# EasyEDA Pro project STM32电赛单片机开发板.eprj, board PCB1
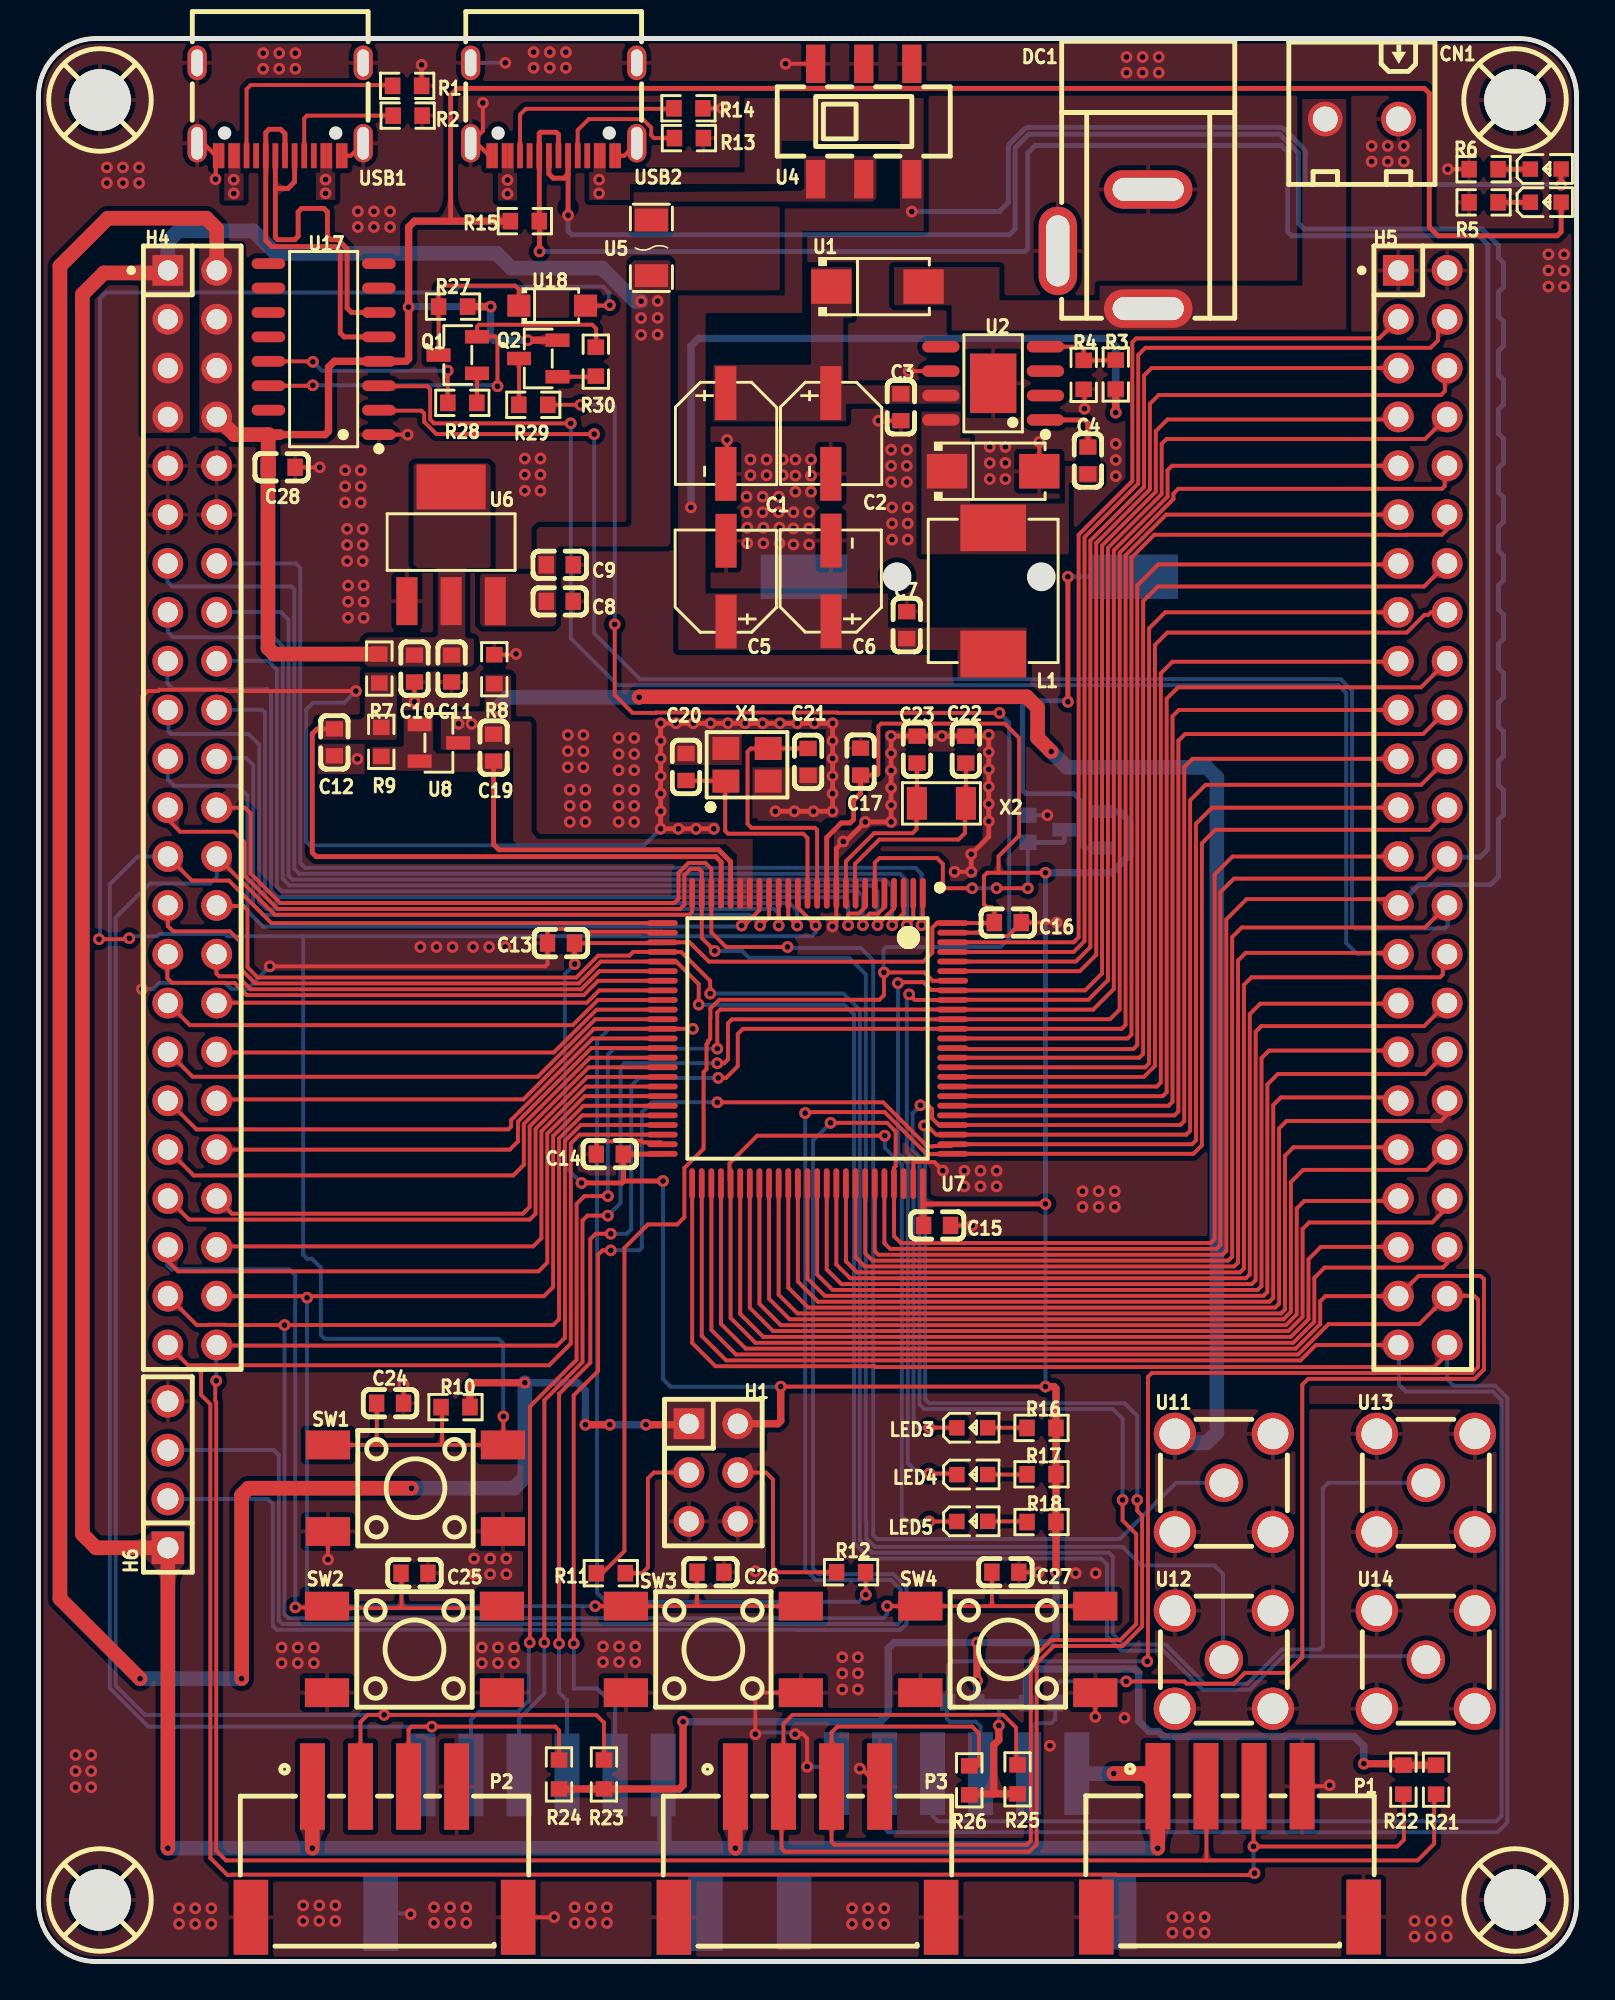
[diagram p3: board, top side]
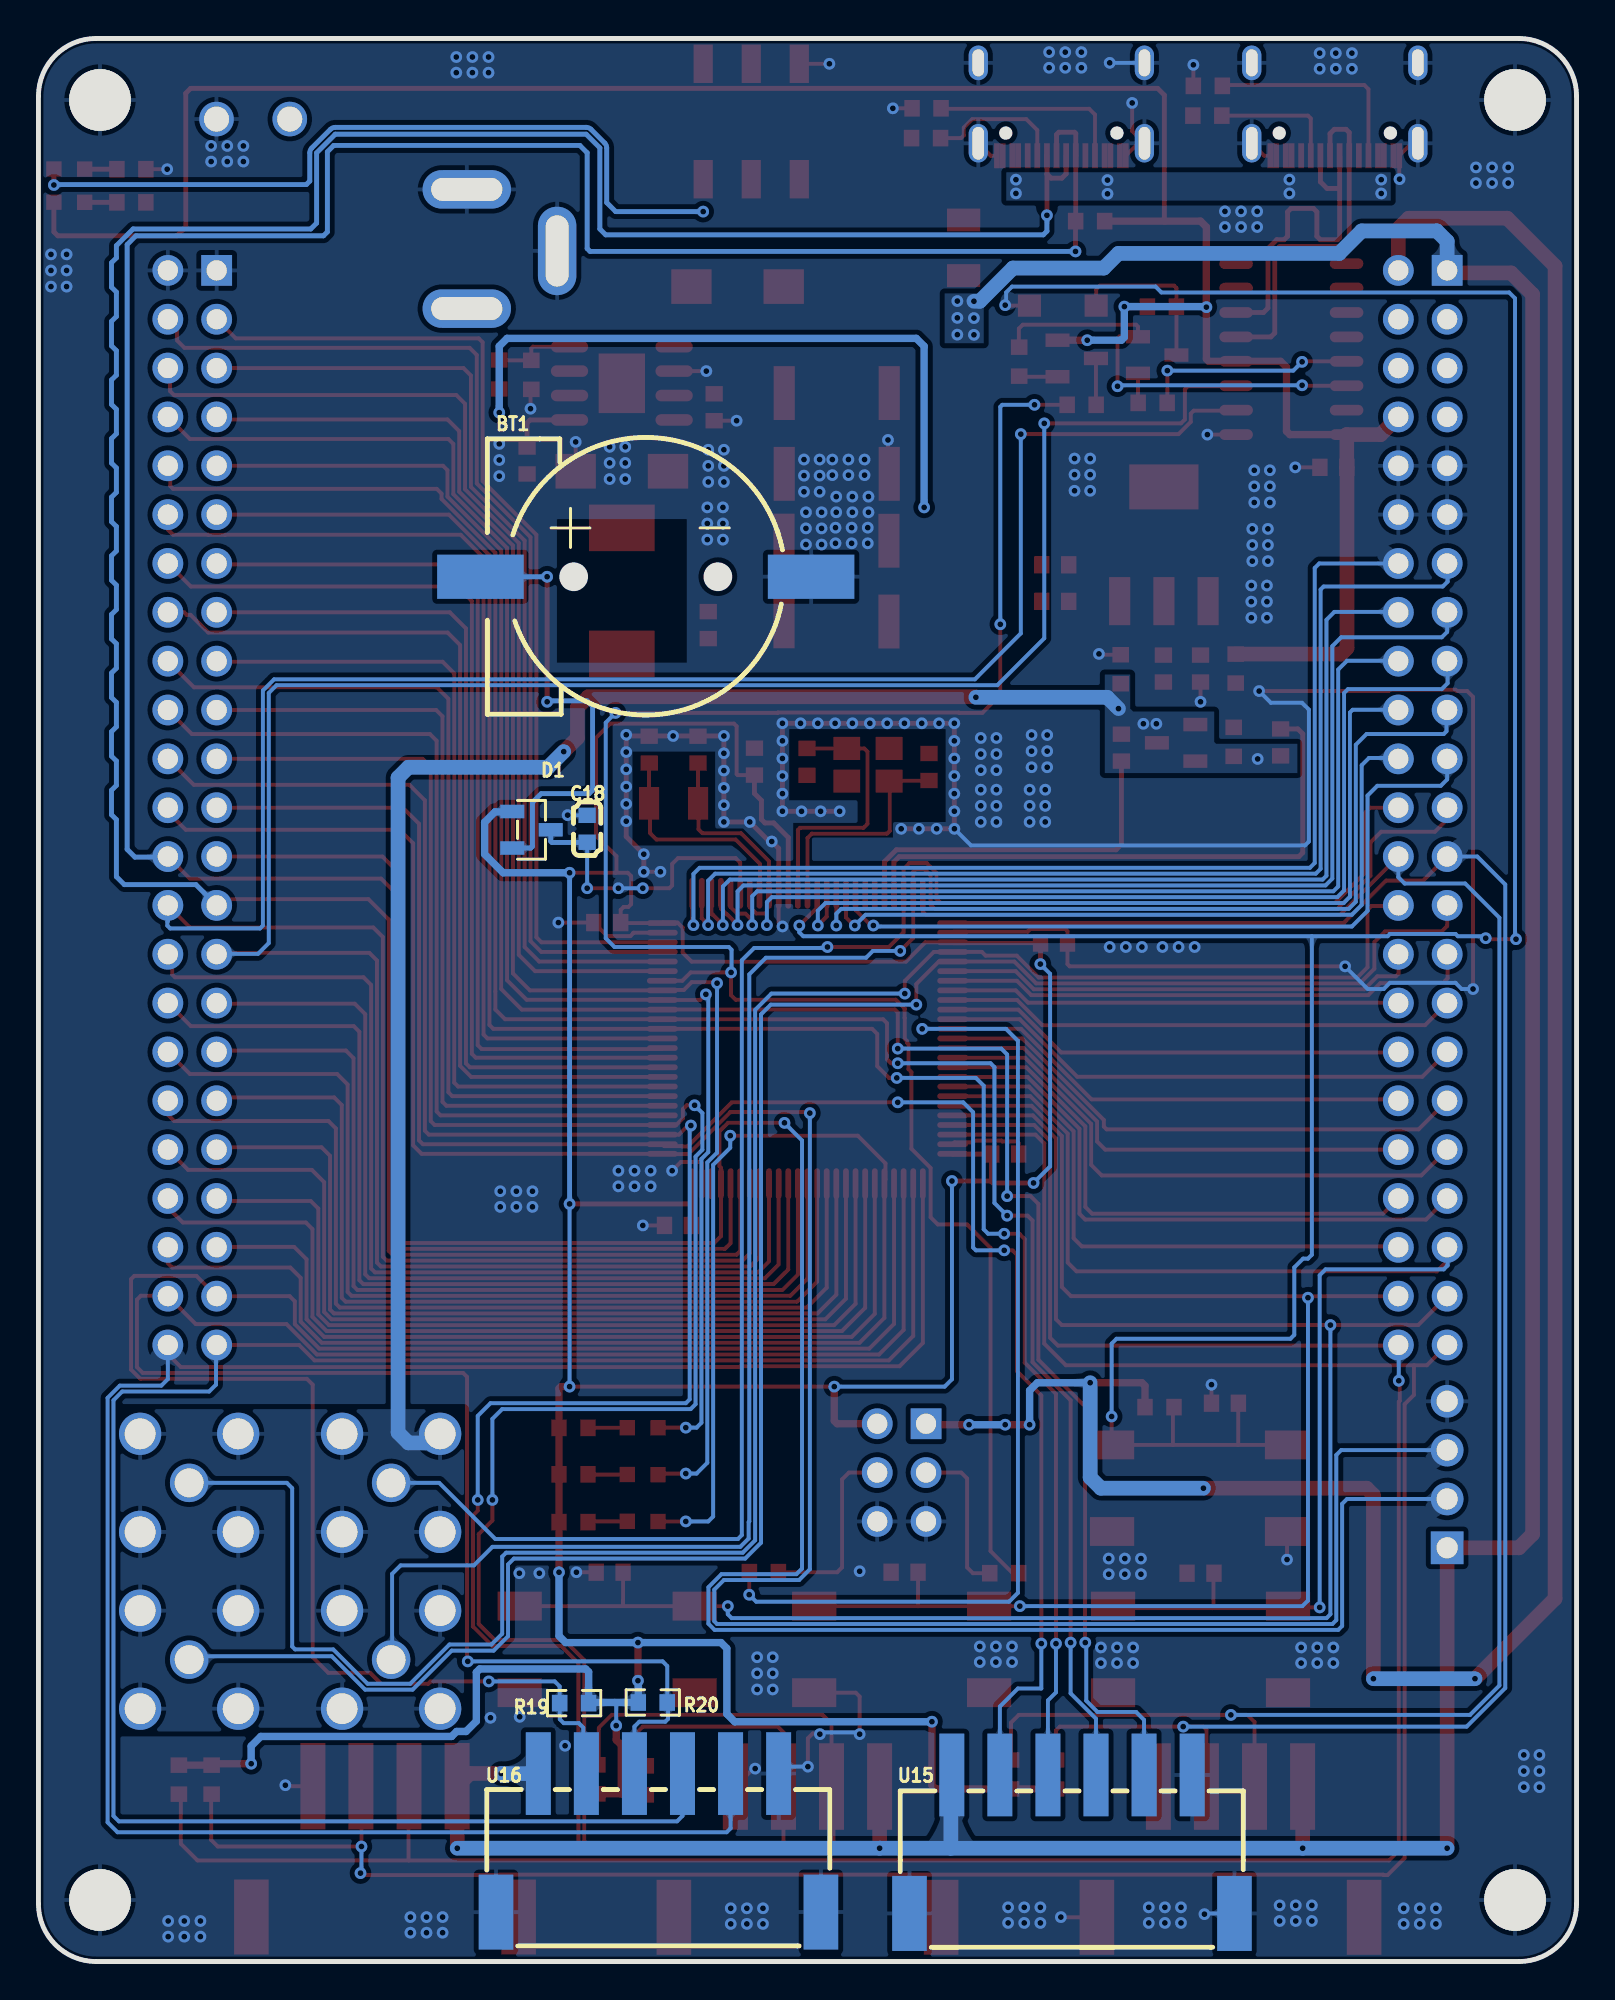
[diagram p4: board, bottom side, seen from below]

Outline 80 x 100 mm; copper layers: Top Layer, Bottom Layer. Coordinates in mm from the lower left corner of the outline.
Outline path: 0,97 0,3 arc(0.88,0.88) 3,0 77,0 arc(79.12,0.88) 80,3 80,97 arc(79.12,99.12) 77,100 3,100 arc(0.88,99.12) 0,97
Stack: Top Layer 0.035mm / Dielectric1 1.51mm FR4 er 4.5 / Bottom Layer 0.035mm

## Design rules (mm)
net PA12: DP2
net PA11: DP2
net DP: DP1
net DN: DP1
template: 自定义配置
spacing copperThickness1oz (default): track to track 0.102, other pairs 0.152 to 0.3
spacing copperThickness2oz: track to track 0.203, other pairs 0.152 to 0.3
track width copperThickness1oz (default): min 0.127, default 0.203, max 2.54
track width copperThickness2oz: min 0.203, default 0.254, max 2.54
differential pair differentialPair (default): width min 0.127, default 0.254, max 2.54; gap min 0.102, default 0.102
via viaSize (default): diameter min 0.5, default 0.61, max 10; hole min 0.3, default 0.305, max 6.3

## Placement (name value [footprint] x y rotation side)
BT1  CR1220-2ZX  [BAT-SMD_CR1220-2ZX]  48.41 72.01 180 bottom
C1  4.7uF  [CAP-SMD_BD5.0-L5.3-W5.3-FD]  35.75 79.46 270 top
C2  4.7uF  [CAP-SMD_BD5.0-L5.3-W5.3-FD]  41.21 79.46 270 top
C3  100nF  [C0603]  44.86 80.82 90 top
C4  10nF  [C0603]  54.58 78.05 270 top
C5  47uF  [CAP-SMD_BD5.0-L5.3-W5.3-FD]  35.76 71.78 90 top
C6  47uF  [CAP-SMD_BD5.0-L5.3-W5.3-FD]  41.22 71.79 90 top
C7  100nF  [C0603]  45.16 69.49 270 top
C8  10uF  [C0603]  27.11 70.73 180 top
C9  100nF  [C0603]  27.11 72.63 180 top
C10  100nF  [C0603]  19.56 67.23 90 top
C11  10uF  [C0603]  21.49 67.23 90 top
C12  10nF  [C0603]  15.39 63.4 90 top
C13  100nF  [C0603]  27.18 52.96 0 top
C14  100nF  [C0603]  29.72 41.99 0 top
C15  100nF  [C0603]  46.74 38.28 180 top
C16  100nF  [C0603]  50.42 54.03 180 top
C17  100nF  [C0603]  42.76 62.39 270 top
C18  100nF  [C0603]  51.46 58.9 90 bottom
C19  10uF  [C0603]  23.67 63.12 270 top
C20  20pF  [C0603]  33.68 62.12 90 top
C21  20pF  [C0603]  40.03 62.38 90 top
C22  10pF  [C0603]  48.23 63.02 270 top
C23  10pF  [C0603]  45.69 63.02 90 top
C24  100nF  [C0603]  18.29 29.03 0 top
C25  100nF  [C0603]  19.56 20.19 0 top
C26  100nF  [C0603]  34.95 20.24 0 top
C27  100nF  [C0603]  50.29 20.24 0 top
C28  100nF  [C0603]  12.65 77.7 0 top
CN1  MX128L-3.81-02P-GN01-Cu-Y-A  [CONN-TH_2P-P3.81_MX128L-3.81-GN01-02P-CU-Y-A]  68.83 95.81 180 top
D1  BAT54C  [SOT-23-3_L2.9-W1.3-P1.90-LS2.4-BR]  54.36 58.85 0 bottom
DC1  -  [DC-005_2.5]  57.4 89.18 90 top
H1  -  [HDR-TH_6P-P2.54-V-R2-C3-S2.54_A2541WV-2X3P]  35.1 25.43 270 top
H4  X6521WV-2x23H-C60D30  [HDR-TH_46P-2.54-V-M-R2-C23-S2.54]  8 60 270 top
H5  X6521WV-2x23H-C60D30  [HDR-TH_46P-2.54-V-M-R2-C23-S2.54]  72 60 270 top
H6  -  [HDR-TH_4P-P2.54-V-M]  6.73 25.32 90 top
L1  15uH  [IND-SMD_L7.3-W6.6]  49.66 71.27 90 top
LED1  -  [LED_0603]  78.45 91.49 0 top
LED2  -  [LED_0603]  78.45 93.22 0 top
LED3  -  [LED_0603]  48.62 27.76 0 top
LED4  -  [LED_0603]  48.62 25.33 0 top
LED5  -  [LED_0603]  48.62 22.89 0 top
P1  -  [CONN-SMD_XH2.54-4PSMD]  61.98 5.72 0 top
P2  -  [CONN-SMD_XH2.54-4PSMD]  18 5.7 0 top
P3  -  [CONN-SMD_XH2.54-4PSMD]  40 5.7 0 top
Q1  S8050  [SOT-23-3_L2.9-W1.3-P1.90-LS2.4-BR]  21.81 83.54 0 top
Q2  S8550  [SOT-23-3_L2.9-W1.3-P1.90-LS2.4-BR]  26 83.36 0 top
R1  5.1K  [R0603]  19.18 97.54 0 top
R2  5.1K  [R0603]  19.2 95.99 0 top
R3  10K  [R0603]  56.03 82.53 90 top
R4  3.16K  [R0603]  54.36 82.51 270 top
R5  2K  [R0603]  75.17 91.48 180 top
R6  5K  [R0603]  75.17 93.2 180 top
R7  0  [R0603]  17.73 67.23 270 top
R8  0  [R0603]  23.71 67.2 270 top
R9  1K  [R0603]  17.83 63.42 270 top
R10  10K  [R0603]  21.69 28.83 0 top
R11  10K  [R0603]  29.77 20.19 0 top
R12  10K  [R0603]  42.27 20.24 0 top
R13  5.1K  [R0603]  33.83 94.82 0 top
R14  5.1K  [R0603]  33.81 96.37 0 top
R15  10K  [R0603]  25.3 90.5 0 top
R16  2K  [R0603]  52.17 27.75 180 top
R17  2K  [R0603]  52.17 25.34 180 top
R18  2K  [R0603]  52.17 22.85 180 top
R19  4.7K  [R0603]  52.14 13.44 180 bottom
R20  4.7K  [R0603]  48.05 13.47 0 bottom
R21  4.7K  [R0603]  72.69 9.46 90 top
R22  4.7K  [R0603]  70.99 9.46 90 top
R23  4.7K  [R0603]  29.41 9.73 270 top
R24  4.7K  [R0603]  27.08 9.73 270 top
R25  4.7K  [R0603]  50.93 9.47 270 top
R26  4.7K  [R0603]  48.41 9.42 270 top
R27  10K  [R0603]  21.56 86.06 180 top
R28  1K  [R0603]  22.05 81.05 0 top
R29  1K  [R0603]  25.74 80.95 180 top
R30  1K  [R0603]  28.99 83.19 270 top
SCREW1  -  [M3螺丝]  3.2 96.8 0 top
SCREW2  -  [M3螺丝]  76.8 96.8 0 top
SCREW3  -  [M3螺丝]  3.2 3.2 0 top
SCREW4  -  [M3螺丝]  76.8 3.2 0 top
SW1  -  [SW-SMD_4P-L6.0-W6.0-P4.50-LS9.0-2]  19.61 24.61 0 top
SW2  -  [SW-SMD_4P-L6.0-W6.0-P4.50-LS9.0-2]  19.56 16.23 0 top
SW3  -  [SW-SMD_4P-L6.0-W6.0-P4.50-LS9.0-2]  35.1 16.23 0 top
SW4  -  [SW-SMD_4P-L6.0-W6.0-P4.50-LS9.0-2]  50.42 16.23 0 top
U1  SS54  [SMA_L4.2-W2.6-LS5.1-RD]  43.64 87.1 0 top
U2  TPS5450QDDARQ1  [SOIC-8_L4.9-W3.9-P1.27-LS6.0-BL-EP]  49.66 82.07 90 top
U3  SS54  [SMA_L4.2-W2.6-LS5.1-RD]  49.66 77.5 0 top
U4  YSSP2AG00  [SW-SMD_YSSP2AG00]  42.93 95.68 0 top
U5  JK-nSMD005/60V  [F1206]  31.88 89.11 270 top
U6  AMS1117-3.3  [SOT-223-3_L6.5-W3.4-P2.30-LS7.0-BR]  21.46 73.71 270 top
U7  STM32F103VET6  [LQFP-100_L14.0-W14.0-P0.50-LS16.0-BL]  40 48 180 top
U8  TL431  [SOT-23-3_L2.9-W1.3-P1.90-LS2.4-BR]  20.83 63.37 180 top
U11  6GHz  [SMA-TH_HL-SMA-KHD2]  61.66 24.89 0 top
U12  6GHz  [SMA-TH_HL-SMA-KHD2]  61.66 15.7 0 top
U13  6GHz  [SMA-TH_HL-SMA-KHD2]  72.16 24.89 0 top
U14  6GHz  [SMA-TH_HL-SMA-KHD2]  72.16 15.7 0 top
U15  XH2.54mm-LI-6P  [CONN-SMD_6P-P2.50-H]  26.24 6.1 180 bottom
U16  XH2.54mm-LI-6P  [CONN-SMD_6P-P2.50-H]  47.75 6.17 180 bottom
U17  CH340C  [SOP-16_L10.0-W3.9-P1.27-LS6.0-BL]  14.83 83.85 90 top
U18  1N4007W  [SOD-123FL_L2.7-W1.8-LS3.7-RD]  26.72 86.11 0 top
USB1  HC-TYPE-C-16P-01B  [USB-C-SMD_KH-TYPE-C-16P]  12.57 96.32 180 top
USB2  HC-TYPE-C-16P-01B  [USB-C-SMD_KH-TYPE-C-16P]  26.8 96.32 180 top
X1  8MHz  [CRYSTAL-SMD_4P-L3.2-W2.5-BL_SIT8008BI]  36.86 62.23 0 top
X2  SF32WK32768D61T002  [CRYSTAL-SMD_L3.2-W1.5-1]  46.96 60.22 0 top

## Footprints (pads in the part's own frame, mm; a bottom-side part is the same pattern mirrored in y, then rotated)
BAT-SMD_CR1220-2ZX
  rect 4.5x2.3 smd: 1(-8.6,0) 2(8.6,0)
C0603
  rect 0.8x0.9 smd: 1(-0.7,0) 2(0.7,0)
CAP-SMD_BD5.0-L5.3-W5.3-FD
  rect 2.8x1.1 smd: 1(-2.1,0) 2(2.1,0)
CONN-SMD_6P-P2.50-H
  rect 1.3x4.3 smd: 1(-6.25,3.6) 2(-3.751,3.6) 3(-1.25,3.6) 4(1.25,3.6) 5(3.75,3.6) 6(6.25,3.6)
  rect 1.8x3.9 smd: 7(-8.45,-3.6) 8(8.45,-3.6)
CONN-SMD_XH2.54-4PSMD
  rect 1.3x4.5 smd: 1(-3.75,3.4) 2(-1.25,3.4) 3(1.25,3.4) 4(3.75,3.4)
  rect 1.8x3.9 smd: 5(-6.95,-3.4) 6(6.95,-3.4)
CONN-TH_2P-P3.81_MX128L-3.81-GN01-02P-CU-Y-A
  round 1.8 hole 1.3: 1(-1.905,0) 2(1.905,0)
CRYSTAL-SMD_4P-L3.2-W2.5-BL_SIT8008BI
  rect 1.4x1.2 smd: 1(-1.1,-0.85) 2(1.1,-0.85) 3(1.1,0.85) 4(-1.1,0.85)
CRYSTAL-SMD_L3.2-W1.5-1
  rect 1.05x1.7 smd: 1(-1.275,0) 2(1.275,0)
DC-005_2.5
  oval 2x4.6 hole 1.2x3.7: 1(-3.227,-0.318) 2(2.973,-0.318)
  oval 4.6x2 hole 3.7x1.2: 3(-0.227,4.382)
F1206
  rect 1.19x1.728 smd: 1(-1.445,0) 2(1.445,0)
HDR-TH_4P-P2.54-V-M
  rect 1.7x1.7 hole 1.1: 1(-3.81,0)
  round 1.7 hole 1.1: 2(-1.27,0) 3(1.27,0) 4(3.81,0)
HDR-TH_6P-P2.54-V-R2-C3-S2.54_A2541WV-2X3P
  rect 1.6x1.6 hole 1.05: 1(-2.54,-1.27)
  round 1.6 hole 1.05: 2(-2.54,1.27) 3(0,-1.27) 4(0,1.27) 5(2.54,-1.27) 6(2.54,1.27)
HDR-TH_46P-2.54-V-M-R2-C23-S2.54
  rect 1.6x1.6 hole 1.05: 1(-27.94,-1.27)
  round 1.6 hole 1.05: 2(-27.94,1.27) 3(-25.4,-1.27) 4(-25.4,1.27) 5(-22.86,-1.27) 6(-22.86,1.27) 7(-20.32,-1.27) 8(-20.32,1.27) 9(-17.78,-1.27) 10(-17.78,1.27) 11(-15.24,-1.27) 12(-15.24,1.27) 13(-12.7,-1.27) 14(-12.7,1.27) 15(-10.16,-1.27) 16(-10.16,1.27) 17(-7.62,-1.27) 18(-7.62,1.27) 19(-5.08,-1.27) 20(-5.08,1.27) 21(-2.54,-1.27) 22(-2.54,1.27) 23(0,-1.27) 24(0,1.27) 25(2.54,-1.27) 26(2.54,1.27) 27(5.08,-1.27) 28(5.08,1.27) 29(7.62,-1.27) 30(7.62,1.27) 31(10.16,-1.27) 32(10.16,1.27) 33(12.7,-1.27) 34(12.7,1.27) 35(15.24,-1.27) 36(15.24,1.27) 37(17.78,-1.27) 38(17.78,1.27) 39(20.32,-1.27) 40(20.32,1.27) 41(22.86,-1.27) 42(22.86,1.27) 43(25.4,-1.27) 44(25.4,1.27) 45(27.94,-1.27) 46(27.94,1.27)
IND-SMD_L7.3-W6.6
  rect 2.424x3.42 smd: 1(3.278,0) 2(-3.278,0)
LED_0603
  rect 0.8x0.8 smd: 1(-0.851,-0.01) 2(0.75,-0.005)
LQFP-100_L14.0-W14.0-P0.50-LS16.0-BL
  oval 0.3x1.6 smd: 1(-6,-7.55) 2(-5.5,-7.55) 3(-5,-7.55) 4(-4.5,-7.55) 5(-4,-7.55) 6(-3.5,-7.55) 7(-3,-7.55) 8(-2.5,-7.55) 9(-2,-7.55) 10(-1.5,-7.55) 11(-1,-7.55) 12(-0.5,-7.55) 13(0,-7.55) 14(0.5,-7.55) 15(1,-7.55) 16(1.5,-7.55) 17(2,-7.55) 18(2.5,-7.55) 19(3,-7.55) 20(3.5,-7.55) 21(4,-7.55) 22(4.5,-7.55) 23(5,-7.55) 24(5.5,-7.55) 25(6,-7.55) 51(6,7.55) 52(5.5,7.55) 53(5,7.55) 54(4.5,7.55) 55(4,7.55) 56(3.5,7.55) 57(3,7.55) 58(2.5,7.55) 59(2,7.55) 60(1.5,7.55) 61(1,7.55) 62(0.5,7.55) 63(0,7.55) 64(-0.5,7.55) 65(-1,7.55) 66(-1.5,7.55) 67(-2,7.55) 68(-2.5,7.55) 69(-3,7.55) 70(-3.5,7.55) 71(-4,7.55) 72(-4.5,7.55) 73(-5,7.55) 74(-5.5,7.55) 75(-6,7.55)
  oval 1.6x0.3 smd: 26(7.55,-6) 27(7.55,-5.5) 28(7.55,-5) 29(7.55,-4.5) 30(7.55,-4) 31(7.55,-3.5) 32(7.55,-3) 33(7.55,-2.5) 34(7.55,-2) 35(7.55,-1.5) 36(7.55,-1) 37(7.55,-0.5) 38(7.55,0) 39(7.55,0.5) 40(7.55,1) 41(7.55,1.5) 42(7.55,2) 43(7.55,2.5) 44(7.55,3) 45(7.55,3.5) 46(7.55,4) 47(7.55,4.5) 48(7.55,5) 49(7.55,5.5) 50(7.55,6) 76(-7.55,6) 77(-7.55,5.5) 78(-7.55,5) 79(-7.55,4.5) 80(-7.55,4) 81(-7.55,3.5) 82(-7.55,3) 83(-7.55,2.5) 84(-7.55,2) 85(-7.55,1.5) 86(-7.55,1) 87(-7.55,0.5) 88(-7.55,0) 89(-7.55,-0.5) 90(-7.55,-1) 91(-7.55,-1.5) 92(-7.55,-2) 93(-7.55,-2.5) 94(-7.55,-3) 95(-7.55,-3.5) 96(-7.55,-4) 97(-7.55,-4.5) 98(-7.55,-5) 99(-7.55,-5.5) 100(-7.55,-6)
M3螺丝
  round 3.2 hole 3.2: 1(0,0)
R0603
  rect 0.806x0.864 smd: 1(-0.753,0) 2(0.753,0)
SMA-TH_HL-SMA-KHD2
  round 2.2 hole 1.6: 1(-2.55,2.55) 2(2.55,2.55) 3(2.55,-2.55) 4(-2.55,-2.55)
  round 2 hole 1.5: 5(0,0)
SMA_L4.2-W2.6-LS5.1-RD
  rect 2.1x1.8 smd: 1(-2.4,0) 2(2.4,0)
SOD-123FL_L2.7-W1.8-LS3.7-RD
  rect 1.2x1.15 smd: 1(-1.735,0) 2(1.735,0)
SOIC-8_L4.9-W3.9-P1.27-LS6.0-BL-EP
  oval 0.602x1.941 smd: 1(-1.905,-2.72) 2(-0.635,-2.72) 3(0.635,-2.72) 4(1.905,-2.72) 5(1.905,2.72) 6(0.635,2.72) 7(-0.635,2.72) 8(-1.905,2.72)
  rect 3.098x2.41 smd: 9(0,0)
SOP-16_L10.0-W3.9-P1.27-LS6.0-BL
  oval 0.56x1.745 smd: 1(-4.445,-2.873) 2(-3.175,-2.873) 3(-1.905,-2.873) 4(-0.635,-2.873) 5(0.635,-2.873) 6(1.905,-2.873) 7(3.175,-2.873) 8(4.445,-2.873) 9(4.445,2.873) 10(3.175,2.873) 11(1.905,2.873) 12(0.635,2.873) 13(-0.635,2.873) 14(-1.905,2.873) 15(-3.175,2.873) 16(-4.445,2.873)
SOT-23-3_L2.9-W1.3-P1.90-LS2.4-BR
  rect 1.25x0.7 smd: 1(1,-0.95) 2(1,0.95) 3(-1,0)
SOT-223-3_L6.5-W3.4-P2.30-LS7.0-BR
  rect 2.5x1.1 smd: 1(2.97,-2.3) 2(2.97,0) 3(2.97,2.3)
  rect 2.34x3.6 smd: 4(-2.97,0)
SW-SMD_4P-L6.0-W6.0-P4.50-LS9.0-2
  rect 2.3x1.5 smd: 1(-4.55,2.25) 2(4.55,2.25) 3(-4.55,-2.25) 4(4.55,-2.25)
SW-SMD_YSSP2AG00
  rect 1x2 smd: 1(-2.5,3) 2(0,3) 3(2.5,3) 4(-2.5,-3) 5(0,-3) 6(2.5,-3)
USB-C-SMD_KH-TYPE-C-16P
  oval 1x2 hole 0.6x1.7: 1(-4.32,1.765) 2(4.32,1.765)
  oval 1x1.8 hole 0.6x1.4: 3(-4.32,-2.415) 4(4.32,-2.415)
  rect 0.3x1.3 smd: A1(-3.35,2.415) A4(-2.55,2.415) A5(-1.25,2.415) A6(-0.25,2.415) A7(0.25,2.415) A8(1.25,2.415) A9(2.55,2.415) A12(3.35,2.415) B1(3.05,2.415) B4(2.25,2.415) B5(1.75,2.415) B6(0.75,2.415) B7(-0.75,2.415) B8(-1.75,2.415) B9(-2.25,2.415) B12(-3.05,2.415)

## Nets
As in the schematic.

Pads without a net: U2 2 3 5; U7 73; U17 7 8 9 10 11 12 15; USB1 A8 B8; USB2 A8 B8

## Via types
v1: diameter 0.61, hole 0.305, Top Layer to Bottom Layer, 449 vias

## Routing (per net, layer and track width the routed paths; a pad name or vN(x,y) marks a point on that pad's centre or on a via; arc(x,y) is an arc through that point)
AGND: length 77.1
  Top Layer w0.762: v1(52.68,62.92) 51.97,63.63 51.97,65.2 51.4,65.77 31.27,65.77 v1(31.24,65.74)
  Bottom Layer w0.762: v1(52.68,62.92) 53.49,62.1 60.76,62.1 61.3,61.56 61.3,27.51 60.76,26.97 59.58,26.97 U11.1 ; v1(31.24,65.74) 24.41,65.74 v1(23.82,65.15)
  vias: v1(16.59,62.53) v1(21.85,64.36) v1(22.53,64.36)
GND: length 198.7
  Top Layer w0.203: v1(24.84,68) 24.8,67.95 R8.1 ; C10.1 v1(19.56,65.51) ; R4.2 54.41,81.71 v1(54.41,80.75) ; v1(26.82,2.31) 26.81,2.3 P2.6 ; v1(12.04,51.75) 26.37,51.75 26.48,51.86 C13.1 26.48,53.58 26.59,53.69 28.4,53.69 28.55,53.55 32.4,53.55 U7.27 ; USB2.1 30.47,93.9 USB2.A1 ; v1(16.51,66.07) 9.77,66.07 9.71,66.13 6.29,66.13 6.23,66.07 5.69,66.07 5.39,65.76 v1(5.39,50.57) ; v1(67.16,9.17) 67.1,9.12 P1.4 ; v1(48.51,56.67) v1(47.65,56.67) ; 39.32,11.86 39.73,11.86 39.98,11.61 v1(39.98,10.13) ; U2.6 v1(45.26,82.7) ; 52.06,77.5 v1(52.06,79.02) ; C14.1 29.02,42.56 29.11,42.65 29.87,42.65 29.91,42.69 31.34,42.69 31.44,42.6 32.35,42.6 U7.49 ; 39.65,13.98 37.49,13.98 37.29,13.78 v1(37.29,11.82) ; v1(35.81,79.12) 35.81,77.42 C1.2 ; C15.1 v1(48.56,38.28) ; R1.2 v1(19.93,98.63) ; U17.1 v1(19.2,79.4) ; C24.2 v1(18.99,30) ; 44.86,80.12 v1(43.69,80.12) ; U7.74 45.5,41.51 45.57,41.58 46.58,41.58 v1(47.04,41.12) ; C27.2 v1(52.02,20.24) ; v1(41.3,53.82) 41.5,54.02 U7.10 ; USB1.1 16.24,93.9 15.92,93.9 ; 54.97,13.98 v1(54.97,12.73) ; P3.4 42.82,10.03 v1(42.72,10.03) ; U7.99 49.05,53.5 49.06,53.49 49.06,53.47 49.21,53.32 50.41,53.32 C16.1 52.88,54.03 ; 15.06,22.36 v1(15.06,20.9) ; USB2.A12 22.8,94.55 USB2.2 23.11,95.19 v1(23.11,96.65) ; 9.22,92.69 USB1.A12 8.57,94.55 USB1.2 ; R14.2 v1(35.56,96.37) ; C28.2 v1(14.63,77.7) ; 74.41,93.2 v1(73.3,93.2) ; U4.1 v1(38.86,98.68)
  Top Layer w0.254: v1(38.33,59.81) v1(39.32,59.81) v1(40.31,59.81) 41.3,59.81 v1(41.3,59.82) v1(41.3,60.73) v1(41.3,61.65) v1(41.3,62.56) v1(41.3,63.47) v1(41.3,64.39) v1(40.36,64.39) v1(39.46,64.39) v1(38.56,64.39) v1(37.67,64.39) v1(36.76,64.39) v1(35.86,64.39) v1(34.96,64.39) v1(34.06,64.39) v1(33.16,64.39) v1(32.36,64.39) v1(32.36,63.47) v1(32.36,62.56) v1(32.36,61.65) v1(32.36,60.73) v1(32.36,59.82) 32.36,58.91 v1(32.36,58.9) v1(33.28,58.9) v1(34.21,58.9) v1(35.13,58.9) ; v1(48.51,56.67) v1(48.51,57.58) 49.43,58.5 v1(49.43,59.3) v1(49.43,60.2) v1(49.43,61.09) v1(49.43,61.99) v1(49.43,62.89) v1(49.43,63.79) 49.37,63.73 v1(46.99,63.73) v1(44.35,63.73) v1(44.35,62.83) v1(44.35,61.93) v1(44.35,61.03) v1(44.35,60.13) v1(44.35,59.26) v1(43,59.26) 41.99,58.24 v1(41.86,58.24) 41.5,57.88 U7.10
  Bottom Layer w0.203: v1(5.39,50.57) 5.97,50.57 6.29,50.89 9.71,50.89 10.03,50.57 10.86,50.57 v1(12.04,51.75) ; v1(16.51,66.07) 15.9,65.46 14.28,65.46 13.92,65.1 13.92,58.24 14.12,58.04 31.5,58.04 v1(32.36,58.9) ; C18.2 52.47,59.6 v1(52.48,59.61) ; USB2.4 v1(24.28,98.73) ; v1(39.36,11.82) 39.27,11.91 37.29,11.91 ; U16.6 41.14,10.13 v1(39.98,10.13) ; U15.8 19.32,2.5 v1(19.35,2.46)
  vias: v1(1.93,10.74) v1(1.93,9.91) v1(1.93,9.07) v1(2.74,10.74) v1(2.74,9.91) v1(2.74,9.07) v1(3.56,93.29) v1(3.56,92.48) v1(4.39,93.29) v1(4.39,92.48) v1(5.23,93.29) v1(5.23,92.48) v1(7.31,2.77) v1(7.31,1.96) v1(8.15,2.77) v1(8.15,1.96) v1(8.99,2.77) v1(8.99,1.96) v1(9.21,92.69) v1(11.68,99.24) v1(11.68,98.42) v1(12.52,99.24) v1(12.52,98.42) v1(12.65,16.33) v1(12.65,15.52) v1(13.36,99.24) v1(13.36,98.42) v1(13.49,16.33) v1(13.49,15.52) v1(13.77,2.92) v1(13.77,2.11) v1(14.33,16.33) v1(14.33,15.52) v1(14.61,2.92) v1(14.61,2.11) v1(15.44,2.92) v1(15.44,2.11) v1(15.95,77.55) v1(15.95,76.71) v1(15.95,75.87) v1(16.05,74.5) v1(16.05,73.66) v1(16.05,72.82) v1(16.1,71.55) v1(16.1,70.71) v1(16.1,69.88) v1(16.61,91.01) v1(16.61,90.2) v1(16.76,77.55) v1(16.76,76.71) v1(16.76,75.87) v1(16.87,74.5) v1(16.87,73.66) v1(16.87,72.82) v1(16.92,71.55) v1(16.92,70.71) v1(16.92,69.88) v1(17.45,91.01) v1(17.45,90.2) v1(18.29,91.01) v1(18.29,90.2) v1(19.86,52.76) v1(20.57,2.82) v1(20.57,2.01) v1(20.7,52.76) v1(21.41,2.82) v1(21.41,2.01) v1(21.54,52.76) v1(22.25,2.82) v1(22.25,2.01) v1(22.61,52.76) v1(22.66,20.96) v1(22.66,20.14) v1(23.06,16.33) v1(23.06,15.52) v1(23.44,52.76) v1(23.5,20.96) v1(23.5,20.14) v1(23.9,16.33) v1(23.9,15.52) v1(24.28,52.76) v1(24.33,20.96) v1(24.33,20.14) v1(24.74,16.33) v1(24.74,15.52) v1(25.3,78.16) v1(25.3,77.32) v1(25.3,76.48) v1(25.76,99.29) v1(25.76,98.48) v1(26.11,78.16) v1(26.11,77.32) v1(26.11,76.48) v1(26.59,99.29) v1(26.59,98.48) v1(27.43,99.29) v1(27.43,98.48) v1(27.53,63.78) v1(27.53,62.94) v1(27.53,62.1) v1(27.63,60.94) v1(27.63,60.1) v1(27.63,59.26) v1(27.89,2.82) v1(27.89,2.01) v1(28.35,63.78) v1(28.35,62.94) v1(28.35,62.1) v1(28.45,60.94) v1(28.45,60.1) v1(28.45,59.26) v1(28.73,2.82) v1(28.73,2.01) v1(29.36,16.38) v1(29.36,15.57) v1(29.57,2.82) v1(29.57,2.01) v1(30.18,63.63) v1(30.18,62.79) v1(30.18,61.95) v1(30.18,60.94) v1(30.18,60.1) v1(30.18,59.26) v1(30.2,16.38) v1(30.2,15.57) v1(30.99,63.63) v1(30.99,62.79) v1(30.99,61.95) v1(30.99,60.94) v1(30.99,60.1) v1(30.99,59.26) v1(31.04,16.38) v1(31.04,15.57) v1(36.83,76.17) v1(36.83,75.36) v1(36.87,74.56) v1(36.87,73.75) v1(37.03,78.11) v1(37.03,77.29) v1(37.29,20.29) v1(37.67,76.17) v1(37.67,75.36) v1(37.71,74.56) v1(37.71,73.75) v1(37.87,78.11) v1(37.87,77.29) v1(38.51,76.17) v1(38.51,75.36) v1(38.54,74.56) v1(38.54,73.75) v1(38.71,78.11) v1(38.71,77.29) v1(39.27,75.36) v1(39.27,74.52) v1(39.27,73.69) v1(39.37,78.11) v1(39.37,77.27) v1(39.37,76.43) v1(40.08,75.36) v1(40.08,74.52) v1(40.08,73.69) v1(40.18,78.11) v1(40.18,77.27) v1(40.18,76.43) v1(41.81,15.82) v1(41.81,14.99) v1(41.81,14.15) v1(42.32,2.77) v1(42.32,1.96) v1(42.62,15.82) v1(42.62,14.99) v1(42.62,14.15) v1(43.15,2.77) v1(43.15,1.96) v1(43.99,2.77) v1(43.99,1.96) v1(44.35,78.61) v1(44.35,77.78) v1(44.35,76.94) v1(44.4,75.62) v1(44.4,74.78) v1(44.4,73.94) v1(45.16,78.61) v1(45.16,77.78) v1(45.16,76.94) v1(45.21,75.62) v1(45.21,74.78) v1(45.21,73.94) v1(48.16,41.12) v1(48.16,40.31) v1(49,41.12) v1(49,40.31) v1(49.48,78.77) v1(49.48,77.93) v1(49.48,77.09) v1(49.84,41.12) v1(49.84,40.31) v1(50.29,78.77) v1(50.29,77.93) v1(50.29,77.09) v1(52.61,11.22) v1(52.96,54.03) v1(53.95,20.19) v1(54.31,40.06) v1(54.31,39.24) v1(54.99,20.19) v1(55.14,40.06) v1(55.14,39.24) v1(56.03,78.92) v1(56.03,78.08) v1(56.03,77.24) v1(55.98,40.06) v1(55.98,39.24) v1(56.49,12.68) v1(56.59,99.03) v1(56.59,98.22) v1(57.43,99.03) v1(57.43,98.22) v1(58.27,99.03) v1(58.27,98.22) v1(58.98,2.31) v1(58.98,1.5) v1(59.82,2.31) v1(59.82,1.5) v1(60.66,2.31) v1(60.66,1.5) v1(69.34,94.41) v1(69.34,93.6) v1(70.18,94.41) v1(70.18,93.6) v1(71.02,94.41) v1(71.02,93.6) v1(71.58,2.11) v1(71.58,1.3) v1(72.42,2.11) v1(72.42,1.3) v1(73.25,2.11) v1(73.25,1.3) v1(78.54,88.77) v1(78.54,87.94) v1(78.54,87.1) v1(79.35,88.77) v1(79.35,87.94) v1(79.35,87.1)
VCC+3.3V: length 504.5
  Top Layer w0.203: 49.96,56.65 49.94,56.67 49.94,57.48 51,58.55 51,63.63 50.26,64.37 43.82,64.37 43.69,64.23 43.69,61.75 43.63,61.69 C17.2 ; 49.96,56.65 49.96,56.62 49.35,56.62 49.17,56.44 49.17,54.98 49.32,54.84 49.56,54.84 49.72,54.69 C16.2 49.69,54 U7.100 47.52,54.03 46.76,54.03 46.49,53.76 46.49,52.46 46.02,51.99 34.88,51.99 33.87,53 U7.28 32.41,52.96 C13.2 ; 49.96,56.65 49.99,56.62 v1(52.38,56.62) ; v1(38.61,29.9) v1(52.38,29.9)
  Top Layer w0.254: 79.2,91.49 79.2,89.94 78.99,89.74 72.8,89.74 72.34,90.2 72.34,97.15 72.09,97.4 21.79,97.4 21.44,97.05 21.44,90.52 21.41,90.5 ; C13.2 27.88,51.88 v1(27.89,51.87) ; v1(52.38,39.4) 46.02,39.4 46,39.42 ; U7.75 46,39.42 ; 46,39.42 46,38.32 C15.2 ; 30.46,40.59 v1(32.49,40.59) ; 30.46,40.59 30.43,40.61 30.43,41.97 C14.2 32.44,41.99 U7.50 ; 30.46,40.59 30.35,40.49 v1(28.24,40.49) ; C17.2 42.76,60.74 42.39,60.38 42.39,59.39 42.22,59.21 41.76,59.21 41,58.45 U7.11
  Top Layer w0.381: U17.16 14.91,79.4 15.09,79.58 15.09,82.91 15.39,83.21 U17.4 19.13,83.21 19.25,83.34 v1(19.25,86.03) 19.25,90.2 19.56,90.5 R15.1 ; R27.1 v1(23.52,86.06) ; R24.2 R23.2 33.33,8.97 33.53,9.17 v1(33.53,12.47) ; Q2.2 v1(25.45,84.31) ; R26.2 48.46,8.72 49.69,8.72 ; H1.1 33.78,27.91 v1(31.6,27.91) ; v1(25.3,30.1) 22.61,30.1 22.44,29.94 R10.2 ; 72.69,10.21 R22.2 70.92,10.29 v1(68.94,10.29) ; v1(38.61,29.9) 38.61,28.12 38.46,27.97 36.37,27.97 ; v1(48.82,16.59) v1(48.82,14.6) ; v1(52.38,29.9) 52.82,29.9 52.93,29.79 R16.1 R17.1 R18.1 v1(52.93,20.24) ; R25.2 49.69,8.72 ; 49.69,8.72 49.69,11.26 49.95,11.52 v1(49.95,12.27) ; v1(28.45,27.91) v1(29.72,27.91)
  Top Layer w0.762: H4.8 10.19,79.4 U17.16 11.95,79.39 C28.1 11.94,77.69 11.94,68.3 12.25,67.99 R7.1 ; v1(10.57,14.71) 10.57,24.26 10.92,24.61 v1(19.41,24.61) ; H4.2 9.27,90.11 8.73,90.65 3.61,90.65 1.12,88.16 1.12,18.87 v1(5.28,14.71)
  Bottom Layer w0.203: v1(38.61,29.9) 32.87,29.9 32.49,30.28 v1(32.49,40.59) ; v1(49.95,12.27) 49.95,13.39 50.03,13.47 ; v1(28.24,40.49) 27.38,41.35 27.38,51.36 v1(27.89,51.87) ; v1(52.38,29.9) v1(52.38,39.4)
  Bottom Layer w0.254: v1(52.38,56.62) v1(52.38,39.4)
  Bottom Layer w0.381: v1(52.93,20.24) 52.93,16.93 52.58,16.59 v1(48.82,16.59) 44.5,16.59 44.2,16.28 44.2,12.88 43.79,12.47 v1(33.53,12.47) ; v1(19.25,86.03) 19.28,86.06 v1(23.52,86.06) 23.52,84.46 23.67,84.31 v1(25.45,84.31) ; v1(52.38,56.62) 55.83,56.62 56.79,57.58 56.79,59.24 56.26,59.78 55.38,59.78 D1.1 ; v1(68.94,10.29) 68.94,11.2 68.43,11.71 58.51,11.71 58.25,11.96 57.76,11.96 57.22,12.5 57.22,15.04 57.05,15.21 51.54,15.21 51.38,15.06 R19.2 51.35,13.47 R20.2 48.8,14.59 v1(48.82,14.6) ; v1(25.3,30.1) 28.04,30.1 28.45,29.69 v1(28.45,27.91) ; v1(29.72,27.91) v1(31.6,27.91)
  Bottom Layer w0.762: v1(19.41,24.61) 24.74,24.61 25.3,25.17 v1(25.3,30.1) ; v1(10.57,14.71) v1(5.28,14.71)
VCC+5V: length 187.1
  Top Layer w0.762: v1(14.24,5.89) 14.24,9.09 P2.1 ; v1(58.22,5.89) 58.22,9.11 P1.1 57.56,9.78 v1(55.93,9.78) ; v1(6.73,5.89) H6.1 3,21.51 2.29,22.22 2.29,86.69 3.4,87.81 6.6,87.81 H4.1 ; v1(36.25,5.89) P3.1
  Bottom Layer w0.762: v1(31.34,86.33) 31.04,86.33 29.31,88.06 24.59,88.06 23.82,88.82 12.34,88.82 11.18,89.99 7.27,89.99 6.73,89.45 H4.1 ; v1(55.93,9.78) 55.92,9.77 U16.1 ; v1(6.73,5.89) v1(14.24,5.89) 32.55,5.89 ; U15.1 32.55,9.65 32.55,5.89 ; 32.55,5.89 v1(36.25,5.89) v1(58.22,5.89)
  vias: v1(31.34,85.46) v1(31.34,84.59) v1(32.21,86.34) v1(32.21,85.47) v1(32.21,84.6)
VCCA+3.3V: length 30.5
  Top Layer w0.254: U7.22 35.51,55.56 35.51,57.18 35.23,57.46 14.44,57.46 14.24,57.66 14.24,63.84 14.5,64.1 C12.2
BOOT0: length 106
  Top Layer w0.203: U7.94 46.51,51 46.08,51.44 v1(43.98,51.44) 43.98,50.25 43.74,50.01 35.41,50.01 34.94,49.55 34.94,49.54 34.95,49.53 34.95,49.07 34.94,49.06 34.94,47.98 34.82,47.87 34.82,47.78 34.75,47.7 34.75,46.41 34.59,46.25 34.59,42.27 33.6,41.27 33.6,38.7 33.22,38.33 31.7,38.33 30.48,37.11 30.48,21.34 29.33,20.19 R11.1 ; v1(49.99,64.93) 41.55,64.93 41.54,64.95 32.13,64.95 32.11,64.93 30.9,64.93 29.97,65.86 v1(29.97,69.54) ; v1(28.19,80.95) R29.1
  Bottom Layer w0.203: v1(43.98,51.44) 43.95,51.46 43.95,52.61 44.09,52.76 50.04,52.76 50.5,53.21 50.5,64.42 v1(49.99,64.93) ; v1(29.97,69.54) 29.97,80.85 29.87,80.95 v1(28.19,80.95)
BOOT1: length 75.8
  Top Layer w0.203: v1(43.03,19.08) 43.03,20.23 R12.2 ; v1(34.04,48.5) U7.37 28.89,48.5 25.22,44.83 9.34,44.83 H4.36
  Bottom Layer w0.203: v1(43.03,19.08) 42.67,18.71 29.51,18.71 29.06,19.17 29.06,47.88 29.68,48.5 v1(34.04,48.5)
CC11: length 7.2
  Top Layer w0.203: USB2.A5 28.05,95.23 28.62,95.81 31.43,95.81 31.87,95.36 31.87,94.96 32.01,94.82 R13.1
CC12: length 10.3
  Top Layer w0.203: USB2.B5 25.05,96.04 25.35,96.34 33.03,96.34 R14.1
CC21: length 6.6
  Top Layer w0.203: USB1.A5 13.82,95.84 13.97,95.99 18.45,95.99
CC22: length 11.2
  Top Layer w0.203: R1.1 18.42,97.58 11.04,97.58 10.82,97.36 USB1.B5
DN: length 18.4
  Top Layer w0.254: U17.6 16.28,85.75 16.05,85.98 16.05,89.07 15.59,89.54 15.21,89.54 15.03,89.72 15.03,90.98 14.85,91.16 13.69,91.16 13.51,90.98 13.51,89.72 13.33,89.54 12.43,89.53 12.32,89.64 12.32,92.2 ; USB1.B7 13.32,92.55 12.98,92.2 12.32,92.2 ; 12.32,92.2 USB1.A7
DP: length 18.4
  Top Layer w0.254: USB1.A6 12.82,95.05 12.6,95.28 11.99,95.28 11.82,95.11 USB1.B6 11.82,89.5 12.14,89.18 15.44,89.18 15.7,88.93 15.7,84.68 15.9,84.48 U17.5
DTR: length 11.2
  Top Layer w0.203: R28.1 21.28,81.06 v1(21.28,82.73) ; U17.13 14.25,83.21 v1(14.28,83.19)
  Bottom Layer w0.203: v1(14.28,83.19) 14.73,82.73 v1(21.28,82.73)
OLCL1: length 11.6
  Top Layer w0.203: C22.2 48.24,62.31 X2.2 48.19,60.17 48.19,58.68 47.85,58.34 43.74,58.34 42.47,57.07 42.47,55.58 U7.8
OLCL2: length 9.5
  Top Layer w0.203: U7.9 42,57.22 43.46,58.67 45.47,58.67 45.67,58.88 45.67,60.2 X2.1 45.69,60.23 C23.1
OSCH1: length 14
  Top Layer w0.203: C21.2 40.03,63.08 X1.3 37.04,63.08 36.88,62.92 36.88,59.16 37.08,58.95 40.39,58.95 40.5,58.84 U7.12
OSCH2: length 12
  Top Layer w0.203: 35.76,61.38 35.74,61.4 33.7,61.4 C20.1 ; U7.13 40,58.42 39.78,58.65 35.87,58.65 35.72,58.79 35.72,61.35 X1.1
PA0: length 93.1
  Top Layer w0.203: H4.24 10.74,60 11.04,59.7 11.04,56.58 12.57,55.04 33.07,55.04 33.29,55.26 33.29,56.61 33.81,57.12 34.7,57.12 35,56.82 U7.23 35,53.52 35.76,52.76 v1(38.96,52.76)
  Bottom Layer w0.203: U11.5 59.16,24.89 56.24,21.97 43.62,21.97 43.42,22.17 43.42,52.06 42.77,52.7 39.01,52.7 v1(38.96,52.76)
PA1: length 99
  Top Layer w0.203: H4.23 6.73,59.39 7.37,58.75 10.16,58.75 10.72,58.19 10.72,56.47 12.45,54.74 33.38,54.74 33.6,54.96 33.6,56.48 33.93,56.81 34.36,56.81 34.5,56.67 U7.24 34.5,53.23 v1(35.18,52.55)
  Bottom Layer w0.203: v1(35.18,52.55) 36.6,52.55 36.95,52.2 42.16,52.2 43.03,51.33 43.03,22.89 43.06,22.85 43.06,22 43.49,21.56 56.39,21.56 57.35,20.6 61.16,20.6 61.61,20.16 61.61,15.75 U12.5
PA2: length 107
  Top Layer w0.203: U7.25 34,54.58 33.85,54.43 12.3,54.43 H4.26 ; P2.2 16.75,12.46 17.12,12.82 v1(17.98,12.82) 29.01,12.82 29.41,12.42 R23.1
  Bottom Layer w0.203: H4.26 9.27,56.39 8.94,56.06 5.79,56.06 4.01,54.28 4.01,14.35 5.54,12.82 v1(17.98,12.82)
PA3: length 102.6
  Top Layer w0.203: H4.25 7.98,56.21 9.91,56.21 12.12,54 U7.26 ; R24.1 27.08,12.01 26.88,12.22 v1(20.46,12.22) 19.4,12.22 19.25,12.06 P2.3
  Bottom Layer w0.203: v1(20.46,12.22) 5.72,12.22 3.71,14.22 3.71,56.01 5.16,57.46 H4.25
PA4: length 110.6
  Top Layer w0.203: H4.28 9.3,54.89 10.67,54.89 10.87,54.69 10.87,51.7 11.4,51.17 27.98,51.17 29.12,52.31 30.74,52.31 30.93,52.5 32.45,52.5 U7.29 33.43,52.5 34.94,50.99 v1(34.94,50.33)
  Bottom Layer w0.203: U13.5 67.08,24.89 66.8,24.61 66.8,16.38 66.65,16.23 64.67,16.23 62.88,14.44 60.66,14.44 58.62,16.49 56.44,16.49 55.88,17.04 55.88,21.06 55.68,21.26 43.37,21.26 42.72,21.9 42.72,49.49 41.88,50.33 v1(34.94,50.33)
PA5: length 104.4
  Top Layer w0.203: H4.27 6.73,53.85 7.01,53.57 9.96,53.57 10.52,53.01 10.52,51.62 11.28,50.86 28.1,50.86 29.24,52 U7.30 33.17,52 34.34,50.83 v1(34.34,49.76)
  Bottom Layer w0.203: U14.5 71.98,15.88 64.74,15.88 63.01,14.14 60.54,14.14 58.51,16.17 56.32,16.17 55.57,16.92 55.57,20.65 55.27,20.95 43.24,20.95 42.42,21.78 42.42,49.25 41.91,49.76 v1(34.34,49.76)
PA6: length 24.9
  Top Layer w0.203: H4.30 9.25,52.36 9.25,51.38 9.4,51.23 10.36,51.23 11.04,50.56 28.23,50.56 29.17,51.5 U7.31
PA7: length 27.7
  Top Layer w0.203: U7.32 29.11,51 28.36,50.25 10.83,50.25 10.21,50.88 9.72,50.88 9.71,50.89 6.94,50.89 6.71,51.13 6.71,52.36 H4.29
PA8: length 51.5
  Top Layer w0.203: U7.67 42,36.41 42.57,35.84 62.5,35.84 62.7,36.04 62.7,50.79 63.09,51.18 72.9,51.18 73.04,51.33 73.04,52.15 H5.30
PA9: length 128.6
  Top Layer w0.203: U17.3 17.73,81.92 20.22,81.92 20.37,81.76 20.37,80.19 20.57,79.98 v1(27.69,79.98) ; U7.68 42.5,36.62 42.98,36.14 62.19,36.14 62.39,36.35 62.39,52.06 62.79,52.45 70.66,52.45 H5.29
  Bottom Layer w0.203: v1(27.69,79.98) 27.69,68.81 30.12,66.37 67.62,66.37 68.02,65.96 68.02,52.96 68.58,52.4 70.71,52.4 H5.29
PA10: length 132.8
  Top Layer w0.203: H5.28 72.12,53.77 62.59,53.77 62.09,53.27 62.09,36.65 61.88,36.45 43.38,36.45 43,36.83 U7.69 ; U17.2 17.73,80.64 19.91,80.64 20.07,80.49 20.07,80.06 20.7,79.43 v1(28.91,79.43)
  Bottom Layer w0.203: H5.28 73.27,54.09 73.3,54.07 73.3,53.86 73.15,53.72 68.48,53.72 68.33,53.87 68.33,66.09 67.74,66.67 31.29,66.67 28.91,69.06 v1(28.91,79.43)
PA11: length 153.2
  Top Layer w0.203: U7.70 43.5,36.94 43.69,36.75 61.58,36.75 61.78,36.96 61.78,54.19 62.84,55.25 70.51,55.25 70.73,55.02 H5.27
  Top Layer w0.254: 27.55,92.95 27.33,92.74 26.77,92.74 26.55,92.96 USB2.A7 ; 27.55,92.95 v1(27.55,90.81) ; 27.55,92.95 USB2.B7
  Bottom Layer w0.254: H5.27 71.81,56 75.53,56 75.95,56.41 75.95,59.38 76.2,59.63 76.2,60.9 75.95,61.16 75.95,62.43 76.2,62.68 76.2,63.95 75.95,64.21 75.95,65.48 76.2,65.73 76.2,67 75.95,67.25 75.95,68.52 76.2,68.78 76.2,70.05 75.95,70.3 75.95,71.57 76.2,71.83 76.2,73.1 75.95,73.35 75.95,74.62 76.2,74.87 76.2,76.14 75.95,76.4 75.95,77.67 76.2,77.92 76.2,79.19 75.95,79.45 75.95,80.72 76.2,80.97 76.2,82.24 75.95,82.49 75.95,83.76 76.2,84.02 76.2,85.29 75.95,85.54 75.95,86.81 76.2,87.07 76.2,88.34 75.95,88.59 75.95,89.23 75.08,90.09 65.84,90.09 65.53,90.4 65.53,94.05 64.56,95.02 51.51,95.02 50.8,94.31 50.8,90.09 50.5,89.79 27.74,89.79 27.55,89.98 v1(27.55,90.81)
PA12: length 152.8
  Top Layer w0.203: U7.71 44,37.36 44.3,37.06 61.27,37.06 61.48,37.26 61.48,55.61 62.18,56.31 72.12,56.31 H5.26
  Top Layer w0.254: USB2.A6 27.05,95 26.92,95.12 26.11,95.12 26.05,95.06 USB2.B6 26.05,93.9 R15.2 26.06,90.49 v1(26.06,88.93)
  Bottom Layer w0.254: H5.26 73.3,57.43 74.98,57.43 75.39,57.84 75.39,89.28 74.93,89.74 65.18,89.74 64.97,89.94 64.97,94.11 64.64,94.44 51.84,94.44 51.46,94.06 51.46,89.08 51.31,88.93 v1(26.06,88.93)
PA13: length 130.7
  Top Layer w0.203: 44.5,40.45 44.5,41.28 44.59,41.36 44.59,43.17 44.14,43.61 v1(41.2,43.61) ; U7.72 44.5,37.72 44.86,37.36 60.97,37.36 61.17,37.57 61.17,56.52 62.11,57.46 H5.25
  Bottom Layer w0.203: H6.2 11.94,24.05 12.19,23.8 12.19,17.45 12.4,17.25 44.83,17.25 45.15,17.57 45.15,19.46 44.47,20.14 40.58,20.14 40.28,20.43 40.28,42.7 v1(41.2,43.61)
PA14: length 128.8
  Top Layer w0.203: H5.24 73.27,59.78 72.34,58.85 61.21,58.85 60.51,58.15 60.51,42.44 60.07,42 U7.76 47.54,41.99 46.2,41.99 44.01,44.17 39.93,44.17 v1(39.88,44.12)
  Bottom Layer w0.203: v1(39.88,44.12) 39.88,20.4 40.44,19.84 44.35,19.84 44.85,19.34 44.85,17.7 44.7,17.55 12.7,17.55 12.5,17.75 12.5,26.34 12.24,26.59 H6.3
PA15: length 96.1
  Top Layer w0.203: v1(29.77,36.98) 29.34,36.98 29.11,36.75 29.11,30.71 27.84,29.44 v1(27.84,16.54) ; H5.23 61.04,60 60.21,59.17 60.21,42.7 60,42.5 U7.77 47.45,42.4 46.54,42.4 46.52,42.38 46.23,42.38 43.94,44.68 v1(35.31,44.68)
  Bottom Layer w0.203: v1(27.84,16.54) 27.84,14.2 29.06,14.2 29.99,13.26 U15.2 ; v1(29.77,36.98) 31.24,36.98 31.39,37.13 31.39,44.16 31.9,44.68 v1(35.31,44.68)
PB: length 4.3
  Top Layer w0.203: R3.2 56.02,83.26 R4.1 54.36,83.89 54.28,83.97 U2.4
PB0: length 24.1
  Top Layer w0.203: H4.34 9.3,47.27 26.8,47.27 29.03,49.5 U7.35
PB1: length 27.5
  Top Layer w0.203: U7.36 28.96,49 25.97,46.01 8.02,46.01 H4.33
PB3: length 106
  Top Layer w0.203: H5.11 58.65,75.24 56.54,73.13 56.54,48.7 56.34,48.5 U7.89 36.64,48.5 36.37,48.23 36.37,46.56 35.76,45.95 v1(35.36,45.95) ; v1(27.08,16.53) 27.08,29.52 28.7,31.14 28.7,37.57 28.98,37.85 v1(29.77,37.85)
  Bottom Layer w0.203: U15.3 27.49,13.58 27.08,14 v1(27.08,16.53) ; v1(35.36,45.95) 31.24,45.95 30.84,45.54 30.84,38.08 30.61,37.85 v1(29.77,37.85)
PB4: length 111.3
  Top Layer w0.203: H5.10 73.14,77.65 73.14,76.72 73,76.58 59.28,76.58 59.03,76.33 59.03,76.05 56.24,73.26 56.24,50.45 ; v1(35.31,46.71) 35.66,46.71 35.86,46.91 35.87,48.79 36.07,49 47.55,49 U7.90 55.73,49 56.24,49.5 56.24,50.44 ; v1(26.31,16.59) 26.31,29.19 28.3,31.17 28.3,38.53 28.55,38.79 v1(29.62,38.79)
  Bottom Layer w0.203: v1(29.62,38.79) 30.28,39.45 30.28,46.51 30.48,46.71 v1(35.31,46.71) ; v1(26.31,16.59) 26.31,13.94 24.99,12.63 U15.4
PB5: length 111.4
  Top Layer w0.203: v1(29.62,39.8) 28.4,39.8 27.99,39.4 27.99,31.29 25.56,28.86 25.56,16.6 v1(25.55,16.59) ; v1(35.31,47.47) 35.31,49.35 35.46,49.5 47.54,49.5 U7.91 54.86,49.5 55.93,50.57 55.93,73.38 58.73,76.18 58.73,77.55 58.96,77.78 H5.9
  Bottom Layer w0.203: U15.5 22.49,12.56 22.91,12.98 24.92,12.98 25.5,13.56 25.5,16.54 v1(25.55,16.59) ; v1(35.31,47.47) 29.92,47.47 29.62,47.17 v1(29.62,39.8)
PB6: length 80.2
  Top Layer w0.203: H5.8 72.12,79.17 58.68,79.17 58.42,78.92 58.42,76.3 55.63,73.51 55.63,51.03 54.61,50.01 47.56,50.01 U7.92 45.58,50 v1(45.29,50.3) ; v1(46.33,27.76) 47.76,27.76 LED3.1
  Bottom Layer w0.203: v1(46.33,27.76) 45.77,27.76 45.52,28.02 45.52,41.73 45.16,42.09 45.16,50.17 v1(45.29,50.3)
PB7: length 81.4
  Top Layer w0.203: H5.7 70.6,80.19 58.72,80.19 58.12,79.58 58.12,76.43 55.32,73.64 55.32,51.39 54.44,50.5 U7.93 47.53,50.52 46.43,50.52 46.02,50.93 44.75,50.93 v1(44.7,50.88) ; v1(46.33,25.38) 47.71,25.38 LED4.1
  Bottom Layer w0.203: v1(44.7,50.88) 44.7,42.06 45.21,41.55 45.21,25.93 45.77,25.38 v1(46.33,25.38)
PB8: length 54.5
  Top Layer w0.203: H5.6 73.15,82.74 73.15,81.66 72.95,81.46 58.27,81.46 57.81,81 57.81,76.56 55.02,73.76 55.02,52.35 54.17,51.5 U7.95
PB9: length 51.7
  Top Layer w0.203: H5.5 57.89,82.86 57.51,82.47 57.51,76.68 54.71,73.89 54.71,52.76 53.96,52 U7.96
PB10: length 130.7
  Top Layer w0.203: H4.46 9.3,32.03 26.97,32.03 27.38,32.44 27.38,42.67 28.21,43.5 U7.47 ; 60.74,5.26 71.73,5.26 72.59,6.12 72.59,8.6 R21.1 ; 60.74,5.26 9.75,5.26 9.25,5.77 9.25,29.11 9.19,29.16 9.19,30.15 v1(9.25,30.2) ; 60.74,5.26 60.75,5.27 60.75,9.1
  Bottom Layer w0.203: v1(9.25,30.2) 9.25,32.04 H4.46
PB11: length 132.7
  Top Layer w0.203: 8.46,31.01 7.78,31.01 H4.45 ; 8.46,31.01 26.56,31.01 27.69,32.13 27.69,42.55 28.14,43 U7.48 ; 8.46,31.01 8.46,29.46 8.94,28.98 8.94,5.39 9.83,4.5 10.04,4.5 10.06,4.52 56.03,4.52 56.05,4.5 63.15,4.5 v1(63.25,4.6) ; R22.1 71.02,8.68 71.02,6.32 70.68,5.98 v1(63.2,5.98) 63.2,9.05 63.25,9.1
  Bottom Layer w0.203: v1(63.25,4.6) 63.2,4.65 v1(63.2,5.98)
PB12: length 111.8
  Top Layer w0.203: H5.46 73.27,31.59 72.59,30.91 43.54,30.91 43.5,30.95 35.21,30.95 34,32.17 U7.51
  Bottom Layer w0.203: H5.46 73.27,30.29 73.61,29.95 75.77,29.95 76.4,29.31 76.4,7.24 75.89,6.72 44.21,6.72 44,6.93 U16.5
PB13: length 106.4
  Top Layer w0.203: U7.52 34.5,32.53 35.77,31.26 65.64,31.26 66.44,32.06 H5.45
  Bottom Layer w0.203: H5.45 70.76,32.03 70.76,30 71.12,29.64 75.64,29.64 76.1,29.19 76.1,7.57 75.82,7.29 46.78,7.29 46.5,7.57 U16.4
PB14: length 102.7
  Top Layer w0.203: v1(57.67,15.61) 57.71,15.65 57.71,30.4 57.91,30.61 74.57,30.61 74.88,30.91 74.88,34.42 74.68,34.62 73.29,34.62 H5.44 71.82,33.15 67.1,33.15 65.52,31.56 36.28,31.56 35,32.84 U7.53
  Bottom Layer w0.203: v1(57.67,15.61) 47.54,15.61 47.29,15.37 47.29,13.47 47.25,13.43 47.25,12.62 47.4,12.47 48.75,12.47 49,12.22 U16.3
PB15: length 97.6
  Top Layer w0.203: U7.54 35.5,33.16 36.79,31.87 65.39,31.87 66.67,33.15 66.67,34.33 66.93,34.6 H5.43 71.78,35.65 75.01,35.65 75.18,35.48 75.18,30.79 74.7,30.3 66.04,30.3 65.74,30 65.74,15.82 64.92,15.01 62.74,15.01 62.18,14.44 59.73,14.44 59.6,14.57 v1(56.58,14.57)
  Bottom Layer w0.203: U16.2 51.66,9.93 51.66,12.17 51.89,12.4 52.68,12.4 52.88,12.6 52.88,13.43 R19.1 52.89,14.31 53.15,14.57 v1(56.58,14.57)
PC0: length 42.8
  Top Layer w0.203: U7.15 39,54.34 v1(39.46,53.87)
  Bottom Layer w0.203: H4.20 9.28,65.09 11.64,65.09 11.79,64.95 11.79,55.37 12.11,55.04 39.06,55.04 39.46,54.64 v1(39.46,53.87)
PC1: length 43.9
  Top Layer w0.203: U7.16 v1(38.5,53.87)
  Bottom Layer w0.203: H4.19 6.77,65.05 6.77,63.97 6.91,63.83 10.92,63.83 11.48,63.27 11.48,55.11 11.85,54.74 38.25,54.74 38.5,54.49 v1(38.5,53.87)
PC2: length 38
  Top Layer w0.203: v1(37.54,53.87) 37.58,53.87 38,54.3 U7.17
  Bottom Layer w0.203: v1(37.54,53.87) 36.98,54.43 11.69,54.43 11.18,54.94 11.18,62.2 10.8,62.59 9.32,62.59 H4.22
PC3: length 40
  Top Layer w0.203: v1(36.58,53.87) 36.58,53.77 36.56,53.76 36.56,53.74 37.5,54.68 U7.18
  Bottom Layer w0.203: H4.21 6.73,61.47 7.06,61.14 10.36,61.14 10.87,60.63 10.87,54.64 11.68,53.82 36.53,53.82 v1(36.58,53.87)
PC4: length 23.5
  Top Layer w0.203: H4.32 9.29,49.86 28.53,49.86 29.17,50.5 U7.33
PC5: length 26.7
  Top Layer w0.203: U7.34 29.1,50 27.79,48.69 7.88,48.69 H4.31
PC6: length 50.1
  Top Layer w0.203: U7.63 40,35.51 40.9,34.62 63.72,34.62 63.92,34.82 63.92,45.61 64.47,46.15 72.12,46.15 H5.34
PC7: length 47.4
  Top Layer w0.203: U7.64 40.5,35.73 41.3,34.92 63.41,34.92 63.61,35.12 63.61,46.98 64.01,47.37 70.66,47.37 H5.33
PC8: length 50.7
  Top Layer w0.203: H5.32 72.07,48.64 63.6,48.64 63.31,48.35 63.31,35.43 63.1,35.23 41.76,35.23 41,35.99 U7.65
PC9: length 47.6
  Top Layer w0.203: U7.66 41.5,36.25 42.22,35.53 62.8,35.53 63,35.74 63,49.26 63.55,49.81 70.7,49.81 H5.31
PC10: length 132.5
  Top Layer w0.203: v1(46.07,43.47) 46.22,43.47 46.69,43 U7.78 59.7,43 59.9,43.2 59.9,60.38 60.71,61.19 71.92,61.19 H5.22 ; R25.1 50.85,10.3 50.85,12.16 50.18,12.83 39.22,12.83 38.75,12.36 P3.2 38.65,9 38.65,5.88 38.81,5.72 51.54,5.72 51.92,6.1 51.92,15.52 52.81,16.41 56.39,16.41 57.4,17.43 57.4,23.19 57.15,23.44 57.15,24
  Bottom Layer w0.203: v1(46.07,43.47) 46.13,43.41 46.13,29.24 46.33,29.03 56.49,29.03 57.15,28.37 v1(57.15,24)
PC11: length 123.4
  Top Layer w0.203: 48.92,10.18 48.92,11.86 48.56,12.22 41.55,12.22 41.25,11.91 P3.3 41.25,6.22 41.4,6.07 51.41,6.07 51.61,6.27 51.61,15.67 52.66,16.72 56.26,16.72 57.1,17.55 57.1,22.22 56.39,22.94 v1(56.39,24) ; H5.21 60.02,62.54 59.6,62.11 59.6,43.7 59.39,43.5 U7.79 46.83,43.5 46.48,43.85 46.48,44.32 46.28,44.53 v1(45.87,44.53)
  Bottom Layer w0.203: v1(56.39,24) 56.39,28.22 55.88,28.73 46.08,28.73 45.82,28.98 45.82,41.86 45.47,42.21 45.47,44.12 v1(45.87,44.53)
PC12: length 45.7
  Top Layer w0.203: U7.80 59.09,44 59.29,44.2 59.29,63.48 59.64,63.83 72.02,63.83 H5.20
PC13: length 50.8
  Top Layer w0.203: U7.7 43,54.83 42.67,54.5 42.18,54.5 42.11,54.43 v1(42.11,53.89)
  Bottom Layer w0.203: 42.11,53.87 42.11,55.09 41.86,55.35 12.44,55.35 12.09,55.7 12.09,65.96 11.89,66.17 7.01,66.17 6.71,66.47 6.71,67.6 H4.17
PD0: length 43.4
  Top Layer w0.203: H5.19 59.31,65.08 58.99,64.75 58.99,44.7 58.78,44.5 U7.81
PD1: length 47.1
  Top Layer w0.203: U7.82 58.48,45 58.68,45.2 58.68,65.67 59.28,66.26 71.91,66.26 H5.18
PD2: length 44.8
  Top Layer w0.203: H5.17 70.7,67.59 58.98,67.59 58.38,66.99 58.38,45.7 58.17,45.5 U7.83
PD3: length 48.5
  Top Layer w0.203: U7.84 57.49,46 58.07,46.58 58.07,68.46 58.72,69.11 71.17,69.11 72.09,70.03 72.29,70.03 72.42,70.16 H5.16
PD4: length 46.2
  Top Layer w0.203: H5.15 58.6,70.16 57.76,69.32 57.76,46.7 57.56,46.5 U7.85
PD5: length 50.2
  Top Layer w0.203: U7.86 57.26,47 57.46,47.2 57.46,70.74 58.22,71.5 72.07,71.5 H5.14
PD6: length 47.7
  Top Layer w0.203: U7.87 47.6,47.45 56.95,47.45 57.15,47.65 57.15,71.56 58.25,72.65 70.68,72.65 H5.13
PD7: length 52
  Top Layer w0.203: H5.12 73.27,74.46 73,74.19 71.17,74.19 71.17,74.19 70.29,74.19 70.29,74.19 58.04,74.19 56.85,73 56.85,48.2 56.65,48 U7.88
PD8: length 81.6
  Top Layer w0.203: LED5.1 46.33,22.88 ; v1(44.02,42.94) 37.38,42.94 35.94,41.5 35.94,40.66 36,40.6 U7.55 36,33.47 37.29,32.17 65.26,32.17 66.36,33.27 66.36,35.55 66.9,36.09 73.04,36.09 73.27,36.31 H5.42
  Bottom Layer w0.203: v1(46.33,22.89) 45.16,22.89 44.91,23.14 44.91,41.43 44.02,42.32 v1(44.02,42.94)
PD9: length 45.3
  Top Layer w0.203: H5.41 70.71,37.16 66.7,37.16 66.06,36.52 66.06,33.4 65.14,32.48 37.7,32.48 36.5,33.68 U7.56
PD10: length 49
  Top Layer w0.203: U7.57 37,33.99 38.21,32.79 65.01,32.79 65.75,33.53 65.75,38.09 66.09,38.43 72.49,38.43 73.27,39.21 H5.40
PD11: length 45.9
  Top Layer w0.203: H5.39 70.6,39.55 65.84,39.55 65.44,39.16 65.44,33.65 64.88,33.09 38.61,33.09 37.5,34.2 U7.58
PD12: length 49.3
  Top Layer w0.203: U7.59 38,34.47 39.07,33.4 64.76,33.4 65.14,33.78 65.14,40.53 65.78,41.17 72.22,41.17 H5.38
PD13: length 46.7
  Top Layer w0.203: H5.37 70.61,42.34 65.28,42.34 64.83,41.9 64.83,33.9 64.63,33.7 39.48,33.7 38.5,34.68 U7.60
PD14: length 50.3
  Top Layer w0.203: H5.36 73.27,44.03 72.94,43.71 64.91,43.71 64.53,43.32 64.53,34.21 64.33,34.01 40.03,34.01 39,35.04 U7.61
PD15: length 47.1
  Top Layer w0.203: H5.35 70.56,44.93 64.62,44.93 64.22,44.54 64.22,34.52 64.02,34.31 40.54,34.31 39.5,35.35 U7.62
PE0: length 55.9
  Top Layer w0.203: U7.97 53.85,52.5 54.41,53.06 54.41,74.07 57.2,76.86 57.2,83.54 57.57,83.91 72.41,83.91 72.79,84.29 72.79,84.92 H5.4
PE1: length 53.1
  Top Layer w0.203: H5.3 69.73,84.4 57.1,84.4 56.9,84.2 56.9,76.99 54.1,74.19 54.1,53.26 53.84,53 U7.98
PE2: length 56.7
  Top Layer w0.203: U7.1 46,53.91 45.93,53.84
  Bottom Layer w0.203: v1(45.93,53.89) 45.93,56.56 45.62,56.87 13.87,56.87 13.62,57.12 13.62,72.46 13.38,72.7 H4.14
PE3: length 58.5
  Top Layer w0.203: U7.2 45.5,54.25 45.37,54.12 45.37,54.1 v1(45.17,53.89)
  Bottom Layer w0.203: H4.13 6.71,72.68 6.71,71.75 6.96,71.5 13.16,71.5 13.31,71.35 13.31,56.82 13.56,56.57 44.8,56.57 45.17,56.2 45.17,53.89
PE4: length 52.8
  Top Layer w0.203: v1(44.41,53.89) 44.61,54.1 44.61,54.12 44.94,54.45 44.96,54.45 45,54.49 U7.3
  Bottom Layer w0.203: H4.16 9.29,70.18 12.6,70.18 13.01,69.77 13.01,56.46 13.21,56.26 44.04,56.26 44.4,55.91 44.4,53.87
PE5: length 54.4
  Top Layer w0.203: v1(43.64,53.89) 43.85,54.1 43.85,54.12 44.17,54.45 44.2,54.45 44.5,54.75 U7.4
  Bottom Layer w0.203: H4.15 6.73,69.14 7.01,68.86 12.24,68.86 12.7,68.4 12.7,56.31 13.06,55.96 43.33,55.96 43.64,55.65 43.64,53.87
PE6: length 49.2
  Top Layer w0.203: U7.5 44,54.83 43.66,54.49 43.23,54.49 42.88,54.14 v1(42.88,53.89)
  Bottom Layer w0.203: 42.88,53.87 42.88,55.4 42.62,55.65 12.65,55.65 12.4,55.9 12.4,67.18 11.94,67.64 9.29,67.64 H4.18
PE7: length 28.5
  Top Layer w0.203: U7.38 28.82,48 24.59,43.76 24.59,43.42 24.44,43.27 8.22,43.27 H4.35
PE8: length 26
  Top Layer w0.203: H4.38 24.52,42.22 24.94,42.64 24.94,43.68 28.76,47.5 U7.39
PE9: length 30.1
  Top Layer w0.203: H4.37 8.07,40.88 24.7,40.88 25.24,41.42 25.24,43.56 28.69,47 U7.40
PE10: length 29.1
  Top Layer w0.203: H4.40 10.06,38.89 25.2,38.89 25.55,39.24 25.55,43.43 28.62,46.5 U7.41
PE11: length 31.8
  Top Layer w0.203: U7.42 28.55,46 25.85,43.3 25.85,38.89 25.55,38.58 7.83,38.58 H4.39
PE12: length 29.9
  Top Layer w0.203: U7.43 28.48,45.5 26.16,43.18 26.16,37.62 25.73,37.19 9.32,37.19 H4.42
PE13: length 72.2
  Top Layer w0.203: 18.83,20.24 18.88,20.19 18.88,18.43 ; U7.44 28.41,45 26.47,43.05 26.47,36.35 26.01,35.89 7.26,35.89 6.73,36.42 H4.41 ; v1(13.36,18.41) 14.94,18.41 SW2.1 15.11,18.38 18.88,18.38 18.88,18.43 ; SW2.2 24,18.38 18.93,18.38 18.88,18.43
  Bottom Layer w0.203: H4.41 6.71,37.12 6.71,36.19 6.91,35.99 13.06,35.99 13.36,35.69 v1(13.36,18.41)
PE14: length 75.3
  Top Layer w0.203: 13.99,34.6 26.29,34.6 26.77,35.08 26.77,42.92 28.35,44.5 U7.45 ; 13.99,34.6 H4.44 ; 13.99,34.6 13.97,34.58 v1(13.97,34.52) ; v1(28.96,18.48) SW3.1 34.25,18.48 ; 39.65,18.48 34.25,18.48 ; 34.25,18.48 C26.1
  Bottom Layer w0.203: v1(13.97,34.52) 13.97,18.77 14.26,18.48 v1(28.96,18.48)
PE15: length 96.2
  Top Layer w0.203: 49.6,18.77 49.59,18.77 C27.1 ; 49.6,18.77 49.59,18.77 49.59,18.48 SW4.1 v1(44.15,18.48) ; 49.6,18.77 49.6,18.5 49.62,18.48 54.97,18.48 ; H4.43 8.23,33.1 8.82,33.1 8.83,33.11 9.71,33.11 9.72,33.1 v1(12.8,33.1) 26.77,33.1 27.08,33.4 27.08,42.8 28.28,44 U7.46
  Bottom Layer w0.203: v1(12.8,33.1) 12.8,18.06 13,17.86 43.94,17.86 44.15,18.06 v1(44.15,18.48)
RST: length 151.6
  Top Layer w0.203: R10.1 20.99,28.77 20.99,26.86 ; v1(3.15,53.16) 4.67,53.16 v1(4.72,53.21) ; 20.99,26.86 24.16,26.86 ; 20.99,26.86 17.6,26.86 ; v1(40.43,53.87) 39.5,54.8 U7.14 ; 17.6,26.86 17.6,29.02 C24.1 ; 17.6,26.86 SW1.1 ; U18.2 29.69,86.11 v1(29.72,86.13) ; v1(24.18,28.34) 24.18,26.88 24.16,26.86
  Bottom Layer w0.203: v1(40.43,53.87) 40.43,53.52 40.22,53.31 13.77,53.31 ; 13.77,53.31 9.82,53.32 9.71,53.43 6.29,53.43 6.18,53.32 4.83,53.32 v1(4.72,53.21) ; 13.77,53.31 13.77,36.75 13.97,36.55 14.22,36.55 14.68,36.09 14.68,32.59 14.88,32.39 23.93,32.39 24.18,32.13 v1(24.18,28.34) ; v1(3.15,53.16) 3.2,53.21 3.2,86.49 3.5,86.79 21.59,86.79 21.9,87.1 29.36,87.1 29.67,86.79 29.67,86.18 v1(29.72,86.13)
RTS: length 23.4
  Top Layer w0.203: R30.1 29.01,83.96 29.01,84.91 28.8,85.12 22.91,85.12 22.81,85.02 Q1.2 22.83,84.51 23.77,84.51 23.88,84.4 v1(23.88,81.92) ; v1(14.28,81.97) 14.25,81.94 U17.14
  Bottom Layer w0.203: v1(23.88,81.92) 23.82,81.97 v1(14.28,81.97)
USB+5V: length 75.8
  Top Layer w0.254: 79.2,93.21 v1(79.2,92.38)
  Top Layer w0.381: v1(56.03,80.54) R3.1
  Bottom Layer w0.254: v1(79.2,92.38) 79.17,92.4 66.07,92.4 65.89,92.58 65.89,94.05 arc(65.86,94.19) 65.78,94.3 64.81,95.27 arc(64.7,95.35) 64.56,95.38 51.51,95.38 arc(51.37,95.35) 51.26,95.27 50.55,94.56 arc(50.47,94.45) 50.44,94.31 50.44,91.47 49.98,91 v1(45.43,91)
  Bottom Layer w0.381: v1(56.03,80.54) 56.03,84 55.63,84.4 34.34,84.4 33.93,84 v1(33.93,75.62)
  vias: v1(10.16,92.66) v1(10.16,91.94) v1(14.94,92.66) v1(14.94,91.94) v1(24.4,92.64) v1(24.4,91.92) v1(29.16,92.66) v1(29.16,91.94)
$1N1597: length 23.6
  Top Layer w0.254: v1(53.54,65.51) v1(53.54,72.01)
  Bottom Layer w0.254: D1.2 54.39,57.9 54.31,57.99 54.31,60.27 53.85,60.73 51.36,60.73 51.18,60.91 51.18,65.28 51.46,65.56 53.49,65.56 v1(53.54,65.51) ; v1(53.54,72.01) BT1.1
$1N1601: length 15.9
  Top Layer w0.203: v1(48.56,55.81) 47.18,55.81 47.04,55.96 47.04,57.07 46.74,57.38 43.74,57.38 43.5,57.14 U7.6 ; v1(49.84,55.81) v1(51.46,55.81)
  Bottom Layer w0.203: v1(51.46,55.81) C18.1 ; v1(48.56,55.81) v1(49.84,55.81)
  Bottom Layer w0.254: D1.3 53.36,58.26 53.29,58.19 51.47,58.19 C18.1
$1N1850: length 18.7
  Top Layer w0.254: C19.2 23.67,58.09 23.95,57.81 35.38,57.81 36,57.19 U7.21
$1N2913: length 8.2
  Top Layer w0.203: R11.2 31.39,20.19 31.7,20.5 31.7,25.12 32,25.43 H1.3
$1N2917: length 10
  Top Layer w0.203: 36.37,25.43 37.85,25.43 38.2,25.07 38.2,20.5 38.46,20.24 R12.1
$2N690: length 3.5
  Top Layer w0.254: C4.1 54.58,80.01 54.43,80.16 U2.1
$2N2102: length 1.7
  Top Layer w0.254: R5.1 77.59,91.48 LED1.1
$2N2263: length 1.7
  Top Layer w0.254: LED2.1 77.59,93.2 R6.1
$3N3084: length 2.1
  Top Layer w0.203: 49.37,27.76 51.41,27.76 R16.2
$3N3088: length 2.1
  Top Layer w0.203: R17.2 51.4,25.32 49.37,25.32
$3N3093: length 2.1
  Top Layer w0.203: 49.37,22.89 51.38,22.89 R18.2
$3N5655: length 8.6
  Top Layer w0.203: Q1.3 R27.2 20.81,87.03 20.93,87.15 24.79,87.15 24.99,86.95 U18.1
$3N5698: length 1.5
  Top Layer w0.203: Q1.1 22.81,81.06 R28.2
$3N5766: length 2.4
  Top Layer w0.203: Q2.3 25,80.96 R29.2
$3N5772: length 2
  Top Layer w0.203: R30.2 28.96,82.41 Q2.1

## Copper pours and planes (outline as drawn; the poured copper is in the pictures)
AGND on Top Layer: 57.86,28.73 75.84,28.73 75.84,12.32 57.86,12.32
AGND on Top Layer: 20.93,66.93 24.59,66.93 24.59,63.02 20.93,63.02
AGND on Top Layer: 22.71,64.49 37.15,64.49 37.15,54.74 22.71,54.74
AGND on Top Layer: 14.52,63.32 16.97,63.32 16.97,61.75 14.52,61.75
AGND on Bottom Layer: 14.52,66.93 24.54,66.93 24.54,61.8 14.52,61.8
AGND on Bottom Layer: 57.86,28.73 75.9,28.73 75.9,11.96 57.86,11.96
GND on Top Layer: -4.22,104.12 84.58,104.12 84.58,-7.95 -4.22,-7.95
GND on Top Layer: 37.13,62.1 41.61,62.1 41.61,59.46 37.13,59.46
GND on Top Layer: 31.95,64.64 36.58,64.64 36.58,62.22 31.95,62.22
GND on Bottom Layer: -2.39,102.64 80.01,102.64 80.01,-5.21 -2.39,-5.21
VCC+3.3V on Top Layer: 8.37,89.21 10.54,89.21 10.54,79.49 8.37,79.49
VCC+3.3V on Top Layer: 16.97,77.9 23.52,77.9 23.52,67.34 16.97,67.34
VCC+3.3V on Top Layer: 32.56,29.24 37.64,29.24 37.64,26.71 32.56,26.71
VCC+5V on Top Layer: 22.96,88.47 32.87,88.47 32.87,69.42 22.96,69.42
VCC+5V on Top Layer: 5.46,89.21 7.87,89.21 7.87,79.48 5.46,79.48
VCC+5V on Bottom Layer: 30.84,86.74 32.87,86.74 32.87,84.15 30.84,84.15
VCCA+3.3V on Top Layer: 14.53,67.03 18.64,67.03 18.64,63.53 14.53,63.53
USB+5V on Top Layer: 28.65,96.9 46.04,96.9 46.04,91.6 28.65,91.6
USB+5V on Top Layer: 9.66,94.55 10.67,94.55 10.67,91.57 9.66,91.57
USB+5V on Top Layer: 33.27,94.13 51.41,94.13 51.41,66.73 33.27,66.73
USB+5V on Top Layer: 14.43,94.58 15.44,94.58 15.44,91.6 14.43,91.6
USB+5V on Top Layer: 23.9,94.56 24.9,94.56 24.9,91.57 23.9,91.57
USB+5V on Top Layer: 28.66,94.58 29.66,94.58 29.66,91.6 28.66,91.6
USB+5V on Bottom Layer: 9.66,93.04 29.66,93.04 29.66,91.57 9.66,91.57
$1N1850 on Top Layer: 17.32,64.8 24.54,64.8 24.54,61.85 17.32,61.85
$2N593 on Top Layer: 35.1,88.11 47.96,88.11 47.96,80.09 35.1,80.09
$2N596 on Top Layer: 44.5,96.85 68.02,96.85 68.02,84.81 44.5,84.81
$2N699 on Top Layer: 45.92,80.59 55.29,80.59 55.29,73.18 45.92,73.18
$2N1537 on Top Layer: 30.95,93.88 43.59,93.88 43.59,89.94 30.95,89.94

Small or netless copper shapes (teardrops, artwork), in the pictures only: 630 on Top Layer, 173 on Bottom Layer
